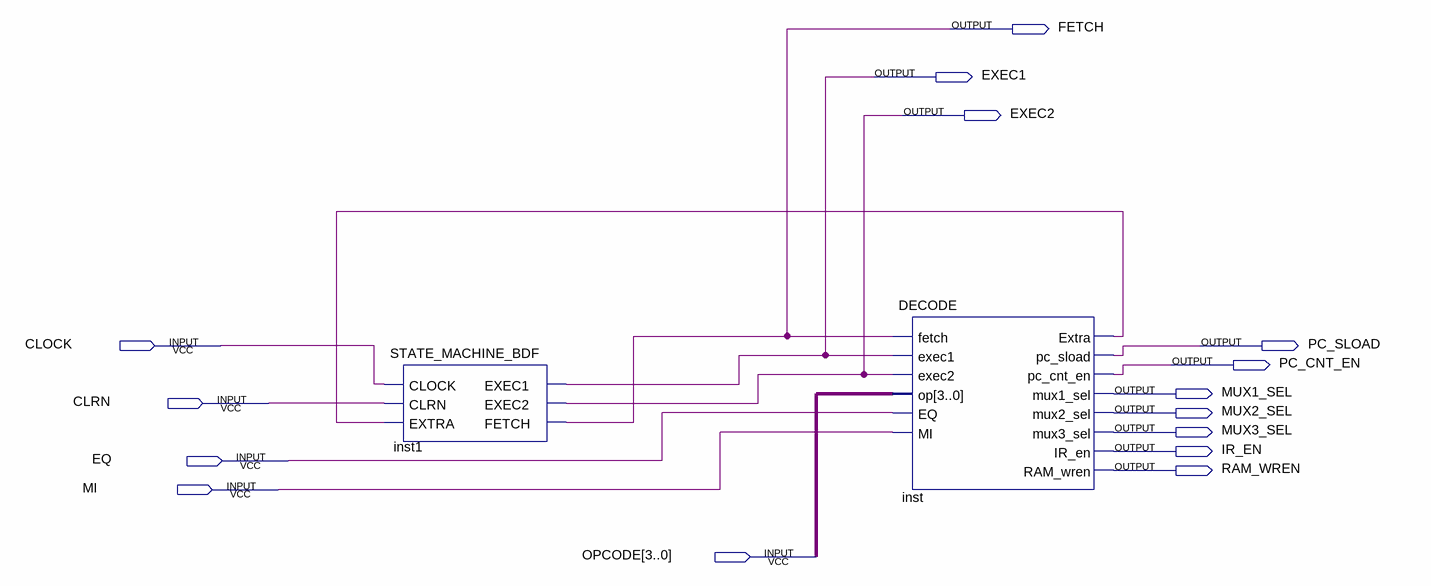
[diagram p0: schematic sheet]
// Quartus schematic DECODE_BDF.bdf as structural Verilog: 2 symbols, 15 pins
module DECODE_BDF (
  input  CLOCK,
  input  CLRN,
  input  EQ,
  input  MI,
  input  [3:0] OPCODE,
  output FETCH,
  output EXEC1,
  output EXEC2,
  output PC_SLOAD,
  output PC_CNT_EN,
  output MUX1_SEL,
  output MUX2_SEL,
  output MUX3_SEL,
  output IR_EN,
  output RAM_WREN
);

  wire inst_extra;

  STATE_MACHINE_BDF inst1 (.CLOCK(CLOCK), .CLRN(CLRN), .EXTRA(inst_extra), .EXEC1(EXEC1), .EXEC2(EXEC2), .FETCH(FETCH));
  DECODE inst (
    .fetch(FETCH), .exec1(EXEC1), .exec2(EXEC2), .op(OPCODE), .EQ(EQ), .MI(MI), .Extra(inst_extra),
    .pc_sload(PC_SLOAD), .pc_cnt_en(PC_CNT_EN), .mux1_sel(MUX1_SEL), .mux2_sel(MUX2_SEL),
    .mux3_sel(MUX3_SEL), .IR_en(IR_EN), .RAM_wren(RAM_WREN));
endmodule
